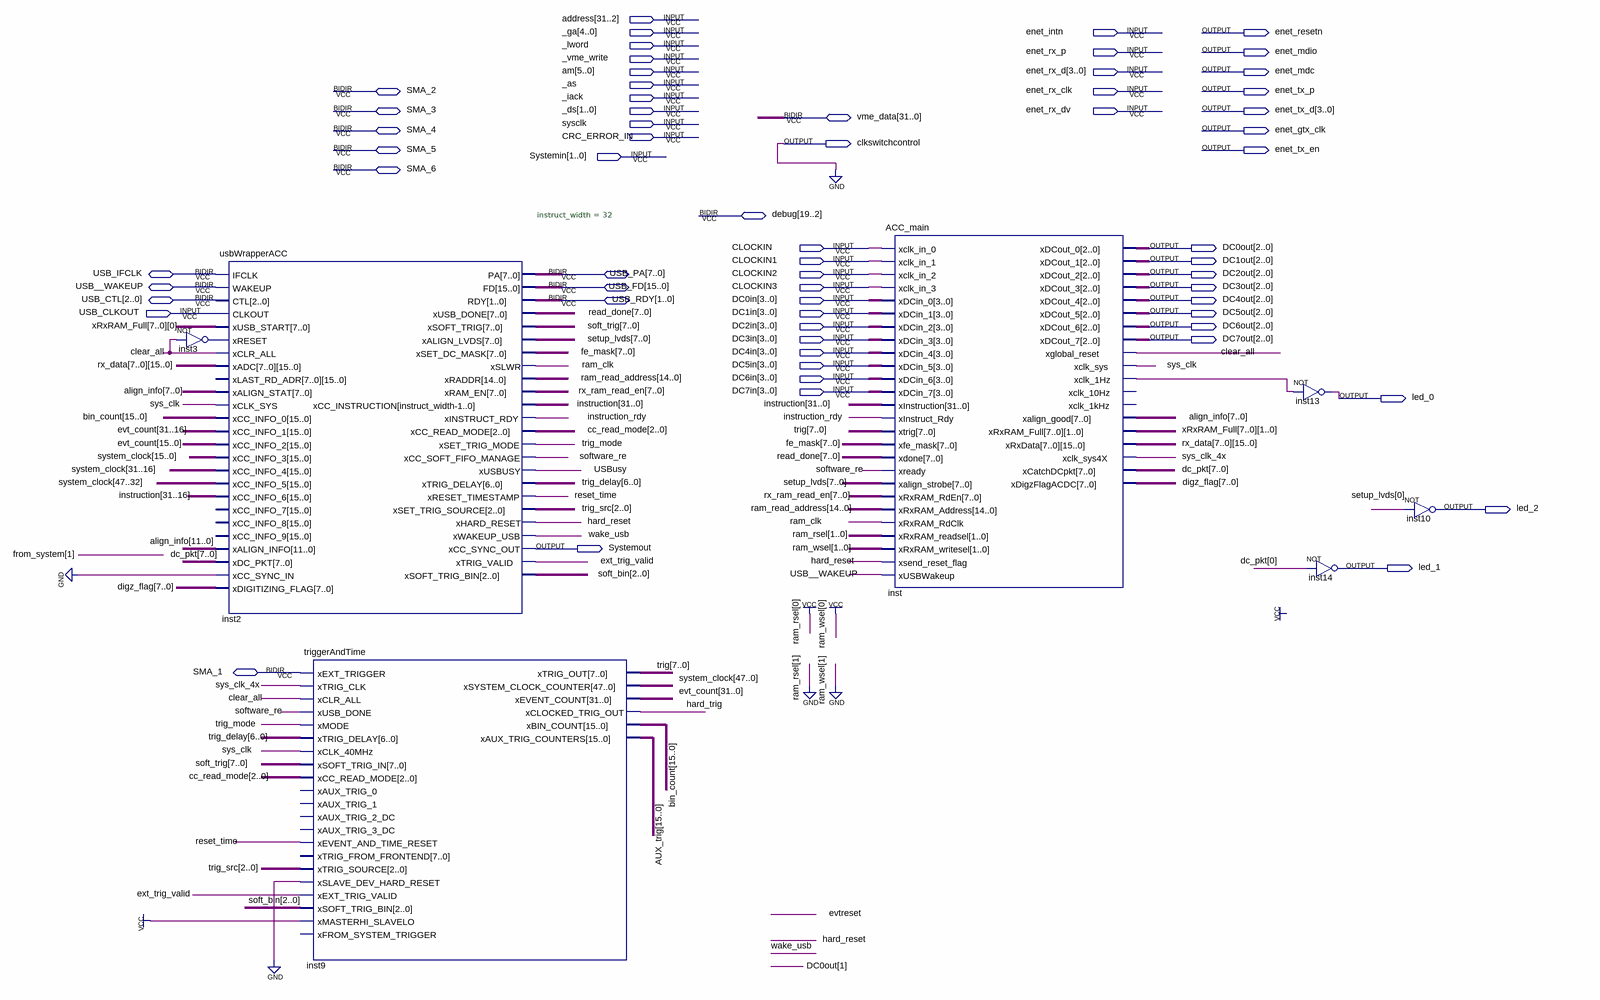
[diagram p0: schematic sheet]
// Quartus schematic ACC_top_v0_1.bdf as structural Verilog: 7 symbols, 63 pins
module ACC_top_v0_1 (
  input  [31:2] address,
  input  [4:0] _ga,
  input  enet_intn,
  input  _lword,
  input  enet_rx_p,
  input  _vme_write,
  input  [5:0] am,
  input  [3:0] enet_rx_d,
  input  _as,
  input  enet_rx_clk,
  input  _iack,
  input  [1:0] _ds,
  input  enet_rx_dv,
  input  sysclk,
  input  CRC_ERROR_IN,
  input  [1:0] Systemin,
  input  CLOCKIN,
  input  CLOCKIN1,
  input  CLOCKIN2,
  input  CLOCKIN3,
  input  [3:0] DC0in,
  input  USB_CLKOUT,
  input  [3:0] DC1in,
  input  [3:0] DC2in,
  input  [3:0] DC3in,
  input  [3:0] DC4in,
  input  [3:0] DC5in,
  input  [3:0] DC6in,
  input  [3:0] DC7in,
  inout  SMA_2,
  inout  SMA_3,
  inout  [31:0] vme_data,
  inout  SMA_4,
  inout  SMA_5,
  inout  SMA_6,
  inout  [19:2] debug,
  inout  USB_IFCLK,
  inout  [7:0] USB_PA,
  inout  USB__WAKEUP,
  inout  [15:0] USB_FD,
  inout  [2:0] USB_CTL,
  inout  [1:0] USB_RDY,
  inout  SMA_1,
  output enet_resetn,
  output enet_mdio,
  output enet_mdc,
  output enet_tx_p,
  output [3:0] enet_tx_d,
  output enet_gtx_clk,
  output clkswitchcontrol,
  output enet_tx_en,
  output [2:0] DC0out,
  output [2:0] DC1out,
  output [2:0] DC2out,
  output [2:0] DC3out,
  output [2:0] DC4out,
  output [2:0] DC5out,
  output [2:0] DC6out,
  output [2:0] DC7out,
  output led_0,
  output led_2,
  output Systemout,
  output led_1
);

  wire clear_all, ext_trig_valid, hard_reset, hard_trig, inst3_out, inst_xclk_1hz, instruction_rdy, ram_clk,
       reset_time, software_re, sys_clk, sys_clk_4x, trig_mode, USBusy, wake_usb;
  wire [1:0] xRxRAM_Full_0, xRxRAM_Full_1, xRxRAM_Full_2, xRxRAM_Full_3, xRxRAM_Full_4, xRxRAM_Full_5,
       xRxRAM_Full_6, xRxRAM_Full_7;
  wire [2:0] cc_read_mode, soft_bin, trig_src;
  wire [6:0] trig_delay;
  wire [7:0] dc_pkt, digz_flag, fe_mask, read_done, rx_ram_read_en, setup_lvds, soft_trig, trig;
  wire [11:0] align_info;
  wire [14:0] ram_read_address;
  wire [15:0] AUX_trig, bin_count, rx_data_0, rx_data_1, rx_data_2, rx_data_3, rx_data_4, rx_data_5,
       rx_data_6, rx_data_7;
  wire [31:0] evt_count, instruction;
  wire [47:0] system_clock;

  not inst3 (inst3_out, clear_all);
  usbWrapperACC #(.instruct_width(32)) inst2 (
    .IFCLK(USB_IFCLK), .WAKEUP(USB__WAKEUP), .CTL(USB_CTL), .CLKOUT(USB_CLKOUT),
    .xUSB_START({xRxRAM_Full_7[0], xRxRAM_Full_6[0], xRxRAM_Full_5[0], xRxRAM_Full_4[0], xRxRAM_Full_3[0], xRxRAM_Full_2[0], xRxRAM_Full_1[0], xRxRAM_Full_0[0]}),
    .xRESET(inst3_out), .xCLR_ALL(clear_all),
    .xADC({rx_data_7, rx_data_6, rx_data_5, rx_data_4, rx_data_3, rx_data_2, rx_data_1, rx_data_0}),
    .xALIGN_STAT(align_info[7:0]), .xCLK_SYS(sys_clk), .xCC_INFO_0(bin_count), .xCC_INFO_1(evt_count[31:16]),
    .xCC_INFO_2(evt_count[15:0]), .xCC_INFO_3(system_clock[15:0]), .xCC_INFO_4(system_clock[31:16]),
    .xCC_INFO_5(system_clock[47:32]), .xCC_INFO_6(instruction[31:16]), .xALIGN_INFO(align_info),
    .xDC_PKT(dc_pkt), .xCC_SYNC_IN(1'b0), .xDIGITIZING_FLAG(digz_flag), .RDY(USB_RDY), .xUSB_DONE(read_done),
    .xSOFT_TRIG(soft_trig), .xALIGN_LVDS(setup_lvds), .xSET_DC_MASK(fe_mask), .xSLWR(ram_clk),
    .xRADDR(ram_read_address), .xRAM_EN(rx_ram_read_en), .xCC_INSTRUCTION(instruction),
    .xINSTRUCT_RDY(instruction_rdy), .xCC_READ_MODE(cc_read_mode), .xSET_TRIG_MODE(trig_mode),
    .xCC_SOFT_FIFO_MANAGE(software_re), .xUSBUSY(USBusy), .xTRIG_DELAY(trig_delay),
    .xRESET_TIMESTAMP(reset_time), .xSET_TRIG_SOURCE(trig_src), .xHARD_RESET(hard_reset),
    .xWAKEUP_USB(wake_usb), .xCC_SYNC_OUT(Systemout), .xTRIG_VALID(ext_trig_valid),
    .xSOFT_TRIG_BIN(soft_bin), .PA(USB_PA), .FD(USB_FD));  // open: xLAST_RD_ADR, xCC_INFO_7, xCC_INFO_8, xCC_INFO_9
  triggerAndTime inst9 (
    .xEXT_TRIGGER(SMA_1), .xTRIG_CLK(sys_clk_4x), .xCLR_ALL(clear_all), .xUSB_DONE(software_re),
    .xMODE(trig_mode), .xTRIG_DELAY(trig_delay), .xCLK_40MHz(sys_clk), .xSOFT_TRIG_IN(soft_trig),
    .xCC_READ_MODE(cc_read_mode), .xEVENT_AND_TIME_RESET(reset_time), .xTRIG_SOURCE(trig_src),
    .xSLAVE_DEV_HARD_RESET(1'b0), .xEXT_TRIG_VALID(ext_trig_valid), .xSOFT_TRIG_BIN(soft_bin),
    .xMASTERHI_SLAVELO(1'b1), .xTRIG_OUT(trig), .xSYSTEM_CLOCK_COUNTER(system_clock),
    .xEVENT_COUNT(evt_count), .xCLOCKED_TRIG_OUT(hard_trig), .xBIN_COUNT(bin_count),
    .xAUX_TRIG_COUNTERS(AUX_trig));  // open: xAUX_TRIG_0, xAUX_TRIG_1, xAUX_TRIG_2_DC, xAUX_TRIG_3_DC, xTRIG_FROM_FRONTEND, xFROM_SYSTEM_TRIGGER
  ACC_main inst (
    .xclk_in_0(CLOCKIN), .xclk_in_1(CLOCKIN1), .xclk_in_2(CLOCKIN2), .xclk_in_3(CLOCKIN3), .xDCin_0(DC0in),
    .xDCin_1(DC1in), .xDCin_2(DC2in), .xDCin_3(DC3in), .xDCin_4(DC4in), .xDCin_5(DC5in), .xDCin_6(DC6in),
    .xDCin_7(DC7in), .xInstruction(instruction), .xInstruct_Rdy(instruction_rdy), .xtrig(trig),
    .xfe_mask(fe_mask), .xdone(read_done), .xready(software_re), .xalign_strobe(setup_lvds),
    .xRxRAM_RdEn(rx_ram_read_en), .xRxRAM_Address(ram_read_address), .xRxRAM_RdClk(ram_clk),
    .xRxRAM_readsel(2'b01), .xRxRAM_writesel(2'b01), .xsend_reset_flag(hard_reset), .xUSBWakeup(USB__WAKEUP),
    .xDCout_0(DC0out), .xDCout_1(DC1out), .xDCout_2(DC2out), .xDCout_3(DC3out), .xDCout_4(DC4out),
    .xDCout_5(DC5out), .xDCout_6(DC6out), .xDCout_7(DC7out), .xglobal_reset(clear_all), .xclk_sys(sys_clk),
    .xclk_1Hz(inst_xclk_1hz), .xalign_good(align_info[7:0]),
    .xRxRAM_Full({xRxRAM_Full_7, xRxRAM_Full_6, xRxRAM_Full_5, xRxRAM_Full_4, xRxRAM_Full_3, xRxRAM_Full_2, xRxRAM_Full_1, xRxRAM_Full_0}),
    .xRxData({rx_data_7, rx_data_6, rx_data_5, rx_data_4, rx_data_3, rx_data_2, rx_data_1, rx_data_0}),
    .xclk_sys4X(sys_clk_4x), .xCatchDCpkt(dc_pkt), .xDigzFlagACDC(digz_flag));  // open: xclk_10Hz, xclk_1kHz
  not inst13 (led_0, inst_xclk_1hz);
  not inst14 (led_1, dc_pkt[0]);
  not inst10 (led_2, setup_lvds[0]);

  assign clkswitchcontrol = 1'b0;
endmodule
